# Altium schematic sheet 2_power.SchDoc: DC-DC VCC3/VCC3A (LP5907SNX)
size A4; SheetNumber: 2; SheetTotal: 3
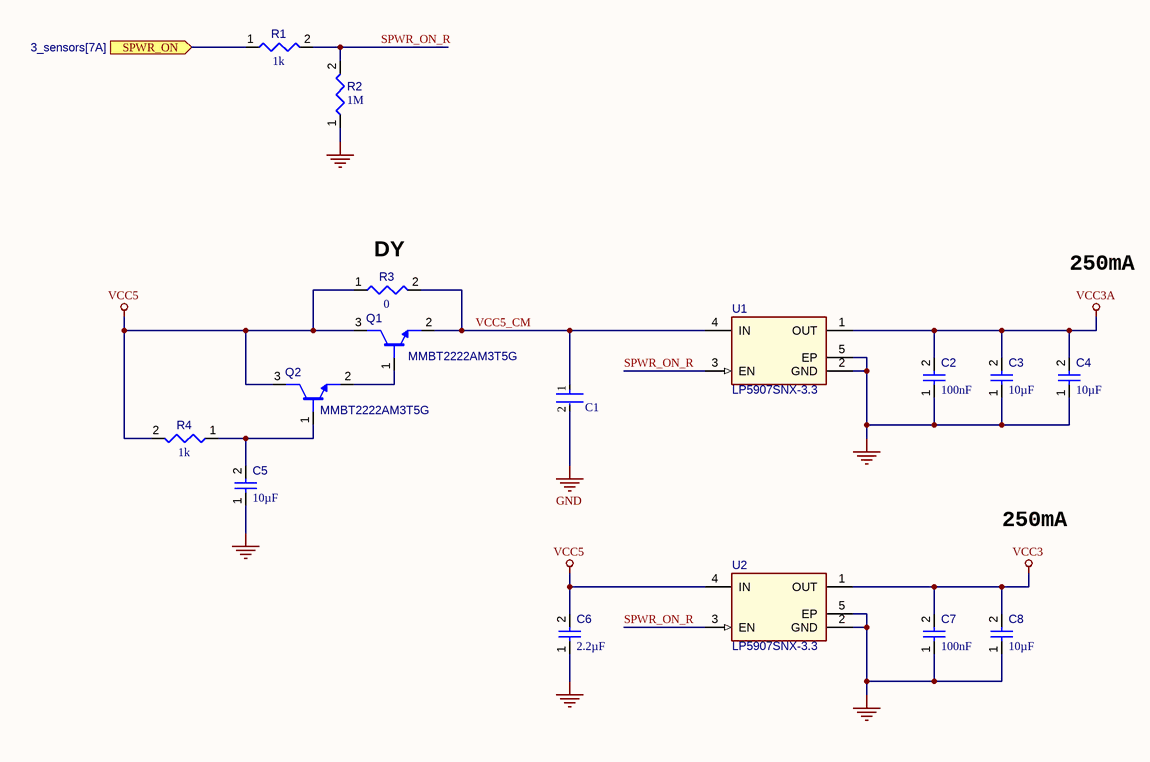
[diagram p0: 2_power.SchDoc]

## Parts
C1  0805ZD225KAT2A  [FP-0805-L_2_01_0_2-W_1_25-IPC_B]  (value not drawn)
C2  value 100nF  [CAPC0402(1005)60_L]  (hidden comment: Capacitor 100nF +/-20% 10V 0402)
C3  value 10µF  [CAPC0402(1005)60_L]  (hidden comment: Capacitor 10µF +/-40% 6.3V 0402)
C4  value 10µF  [CAPC0402(1005)60_L]  (hidden comment: Capacitor 10µF +/-40% 6.3V 0402)
C5  value 10µF  [CAPC0402(1005)60_L]  (hidden comment: Capacitor 10µF +/-40% 6.3V 0402)
C6  value 2.2µF  [CAPC0402(1005)60_L]  (hidden comment: Capacitor 2,2µF +/-20% 10V 0402)
C7  value 100nF  [CAPC0402(1005)60_L]  (hidden comment: Capacitor 100nF +/-20% 10V 0402)
C8  value 10µF  [CAPC0402(1005)60_L]  (hidden comment: Capacitor 10µF +/-40% 6.3V 0402)
Q1  MMBT2222AM3T5G  [ROHM-SOT723-3_V]
Q2  MMBT2222AM3T5G  [ROHM-SOT723-3_V]
R1  value 1k  [RESC0402(1005)_L]  (hidden comment: Resistor 1K +/-5 % 0402 63 mW)
R2  value 1M  [RESC0402(1005)_L]  (hidden comment: Resistor 1M +/-5 % 0402 63 mW)
R3  value 0  [RESC0402(1005)_L]  (hidden comment: Jumper 0402)
R4  value 1k  [RESC0402(1005)_L]  (hidden comment: Resistor 1K +/-5 % 0402 63 mW)
U1  LP5907SNX-3.3  [TI-DQN4-480X480TP_V]
U2  LP5907SNX-3.3  [TI-DQN4-480X480TP_V]

## Ports
SPWR_ON (in, see 3_sensors[7A])

## Nets
GND: C1.2 C2.1 C3.1 C4.1 C5.1 C6.1 C7.1 C8.1 R2.1 U1.2(GND) U1.5(EP) U2.2(GND) U2.5(EP)
VCC3: C7.2 C8.2 U2.1(OUT)
VCC3A: C2.2 C3.2 C4.2 U1.1(OUT)
VCC5: C6.2 Q1.3(C) Q2.3(C) R3.1 R4.2 U2.4(IN)
SPWR_ON: R1.1 ; port SPWR_ON
SPWR_ON_R: R1.2 R2.2 U1.3(EN) U2.3(EN)
VCC5_CM: C1.1 Q1.2(E) R3.2 U1.4(IN)
NetC5_2: C5.2 Q2.1(B) R4.1
NetQ1_1: Q1.1(B) Q2.2(E)

## Notes on the sheet
- (near R3) DY
- 250mA
- Title
- Size:
- Date:
- A4
- Number:
- Time:
- Revision:
- Sheet
- of
- File:

## Library data of the parts
C1 = CMP-001-00119-1: Ceramic Capacitor, Multilayer, Ceramic, 10V, 10% +Tol, 10% -Tol, X5R, 15% TC, 2.2uF, Surface Mount, 0805; Capacitor Type: Ceramic; Max Operating Temperature: 85°C; Min Operating Temperature: -55°C; RoHS Compliant: Yes
C2 C7 = CMP-001-00061-9: Chip Capacitor, 100nF +/-20%, 10V, 0402, Thickness 0.6 mm; Manufacturer 1: KEMET; Manufacturer Lifecycle 1: Volume Production; Manufacturer Part Number 1: C0402C104K8RACTU; Tolerance: 20%; Moeda: USD; Preço: 1: 0.013; Preço: 10: 3.38; Preço:100: 28.6; Preço:1000: 130; Min Operating Temperature: -55°C; Voltage Rating: 10V; Max Operating Temperature: 85°C; Pins: 2; Mounting Technology: SMT; Case/Package: 0402; Imagem: https://sigma.octopart.com/cdn-cgi/image/width=75,fit=contain,quality=85,format=auto/10190940/image/Kemet-C0402C104K8RACTU.jpg; Quantity: 26
C3-C5 C8 = CMP-001-00074-8: Chip Capacitor, 10µF +/-40%, 6.3V, 0402, Thickness 0.6 mm; Tolerance: 10%; Mounting Technology: SMT; Min Operating Temperature: -55°C; Voltage Rating: 6.3V; Case/Package: 0402; Pins: 2; Max Operating Temperature: 85°C
C6 = CMP-001-00056-9: Chip Capacitor, 2,2µF +/-20%, 10V, 0402, Thickness 0.6 mm; Manufacturer 1: Murata; Manufacturer Lifecycle 1: Volume Production; Manufacturer Part Number 1: GRM155R61C225KE44D; Tolerance: 10%; Moeda: USD; Preço: 1: 0.051; Preço: 10: 5.1; Preço:100: 35.7; Preço:1000: 273; Min Operating Temperature: -55°C; Case/Package: 0603; Voltage Rating: 10V; Pins: 2; Max Operating Temperature: 85°C; Mounting Technology: SMT; Imagem: https://search.murata.co.jp/Ceramy/image/img/A01X/KGJ4.png; Quantity: 27
Q1 Q2 = CMP-013-00028-1: NPN General Purpose Transistor, 3-Pin SOT-723, Pb-Free, Tape and Reel; ComponentLink1Description: Manufacturer URL; ComponentLink2URL: http://www.onsemi.cn/pub_link/Collateral/MMBT2222AM3-D.PDF; ComponentLink3URL: http://www.onsemi.com/pub_link/Collateral/631AA.PDF; ComponentLink2Description: Datasheet; ComponentLink3Description: Package Specification; Mounting Technology: SMT; ComponentLink1URL: http://www.onsemi.com/; Case/Package: SOT-723; RoHS Compliant: TRUE; Pins: 3
R1 R4 = CMP-009-00157-3: Chip Resistor, 1 kOhms, +/-5 %, 63 mW, -55 to 155 degC, 0402; Manufacturer 1: Yageo; Manufacturer Lifecycle 1: Volume Production; Manufacturer Part Number 1: RC0402JR-071KL; Power: 63mW; Tolerance: 5%; __ORIG_LIFECYCLESTATEGUID__: 706004B5-C76E-482E-903B-BA0E4FAE086A; Moeda: USD; Preço: 1: 0.011; Preço: 10: 0.44; Preço:100: 2.4; Preço:1000: 16; Case/Package: 0402; Max Operating Temperature: 155°C; Min Operating Temperature: -55°C; Pins: 2; Quantity: 23
R2 = CMP-009-00151-3: Chip Resistor, 1 MOhms, +/-5 %, 63 mW, -55 to 155 degC, 0402; Manufacturer 1: Bourns; Manufacturer Lifecycle 1: Volume Production; Manufacturer Part Number 1: CR0402-JW-105GLF; Power: 63mW; Tolerance: 5%; __ORIG_LIFECYCLESTATEGUID__: 706004B5-C76E-482E-903B-BA0E4FAE086A; Moeda: USD; Preço: 1: 0.006; Preço: 10: 0.24; Preço:100: 1.6; Preço:1000: 8; Case/Package: 0402; Max Operating Temperature: 155°C; Min Operating Temperature: -55°C; Pins: 2; Quantity: 534
R3 = CMP-009-00148-4: Manufacturer 1: Yageo; Manufacturer Lifecycle 1: Volume Production; Manufacturer Part Number 1: RC0402JR-070RL; __ORIG_LIFECYCLESTATEGUID__: 706004B5-C76E-482E-903B-BA0E4FAE086A; Moeda: USD; Preço: 1: 0.007; Preço: 10: 0.07; Preço:100: 0.3; Preço:1000: 3; SKA: 12358745; Case/Package: 0402; Max Operating Temperature: 155°C; Min Operating Temperature: -55°C; Pins: 2; Quantity: 75
U1 U2 = CMP-019-00040-2: Ultra-Low-Noise, Low-IQ LDO, 3.3 V, 0.25 A, -40 to 125 degC, 4-Pin X2SON, RoHS, Tape and Reel; Manufacturer 1: Texas Instruments; Manufacturer Lifecycle 1: Volume Production; Manufacturer Part Number 1: LP5907SNX-3.3/NOPB; Output Voltage: 3.3V; Moeda: USD; Preço: 1: 0.513; Preço: 10: 5.13; Preço:100: 38.3; Preço:1000: 238; Min Operating Temperature: -40°C; Max Operating Temperature: 125°C; Pins: 5; Quantity: 771